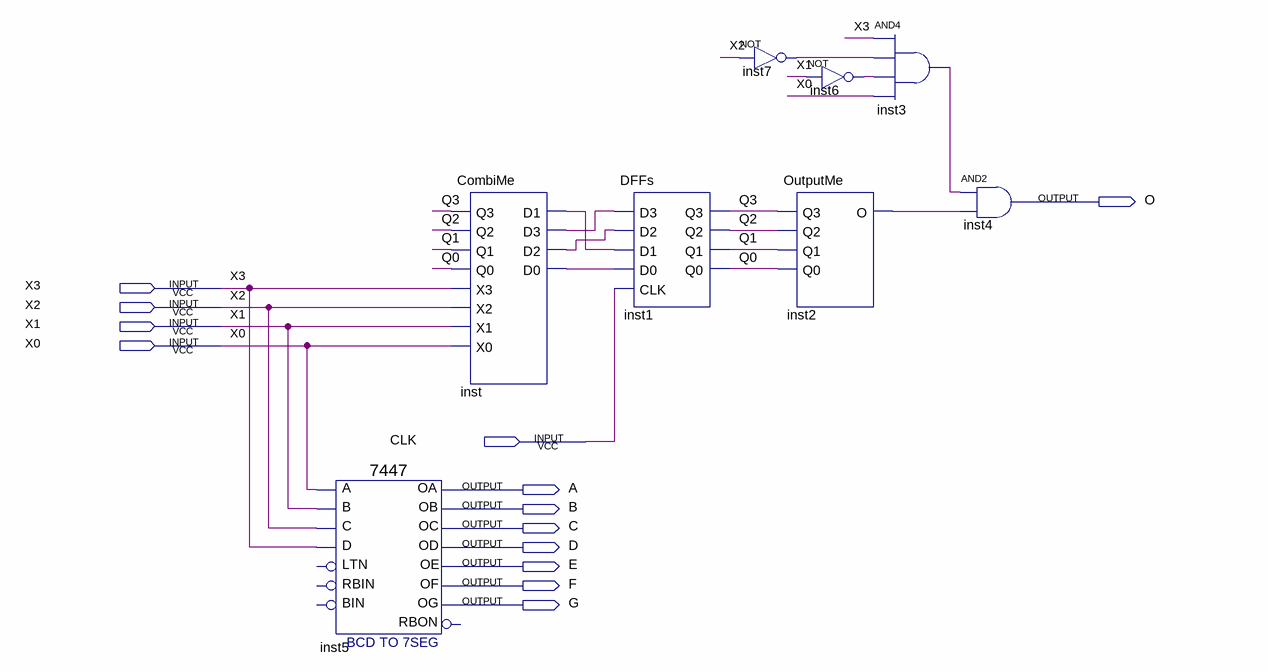
[diagram p0: schematic sheet]
// Quartus schematic MSSVMe.bdf as structural Verilog: 8 symbols, 13 pins
module MSSVMe (
  input  X3,
  input  X2,
  input  X1,
  input  X0,
  input  CLK,
  output O,
  output A,
  output B,
  output C,
  output D,
  output E,
  output F,
  output G
);

  wire inst2_o, inst3_out, inst6_out, inst7_out, inst_d0, inst_d1, inst_d2, inst_d3, Q0, Q1, Q2, Q3;

  \7447  inst5 (
    .B(X1), .C(X2), .D(X3), .A(X0), .OB(B), .OC(C), .OE(E), .OD(D), .OF(F), .OG(G), .OA(A));  // open: LTN, RBIN, BIN, RBON
  CombiMe inst (
    .Q3(Q3), .Q2(Q2), .Q1(Q1), .Q0(Q0), .X3(X3), .X2(X2), .X1(X1), .X0(X0), .D1(inst_d1), .D3(inst_d3),
    .D2(inst_d2), .D0(inst_d0));
  DFFs inst1 (.D3(inst_d3), .D2(inst_d2), .D1(inst_d1), .D0(inst_d0), .CLK(CLK), .Q3(Q3), .Q2(Q2), .Q1(Q1), .Q0(Q0));
  not inst7 (inst7_out, X2);
  not inst6 (inst6_out, X1);
  OutputMe inst2 (.Q3(Q3), .Q2(Q2), .Q1(Q1), .Q0(Q0), .O(inst2_o));
  and inst3 (inst3_out, X3, inst7_out, inst6_out, X0);
  and inst4 (O, inst3_out, inst2_o);
endmodule
